# EAGLE design droneHAT (EAGLE 7.4.0)
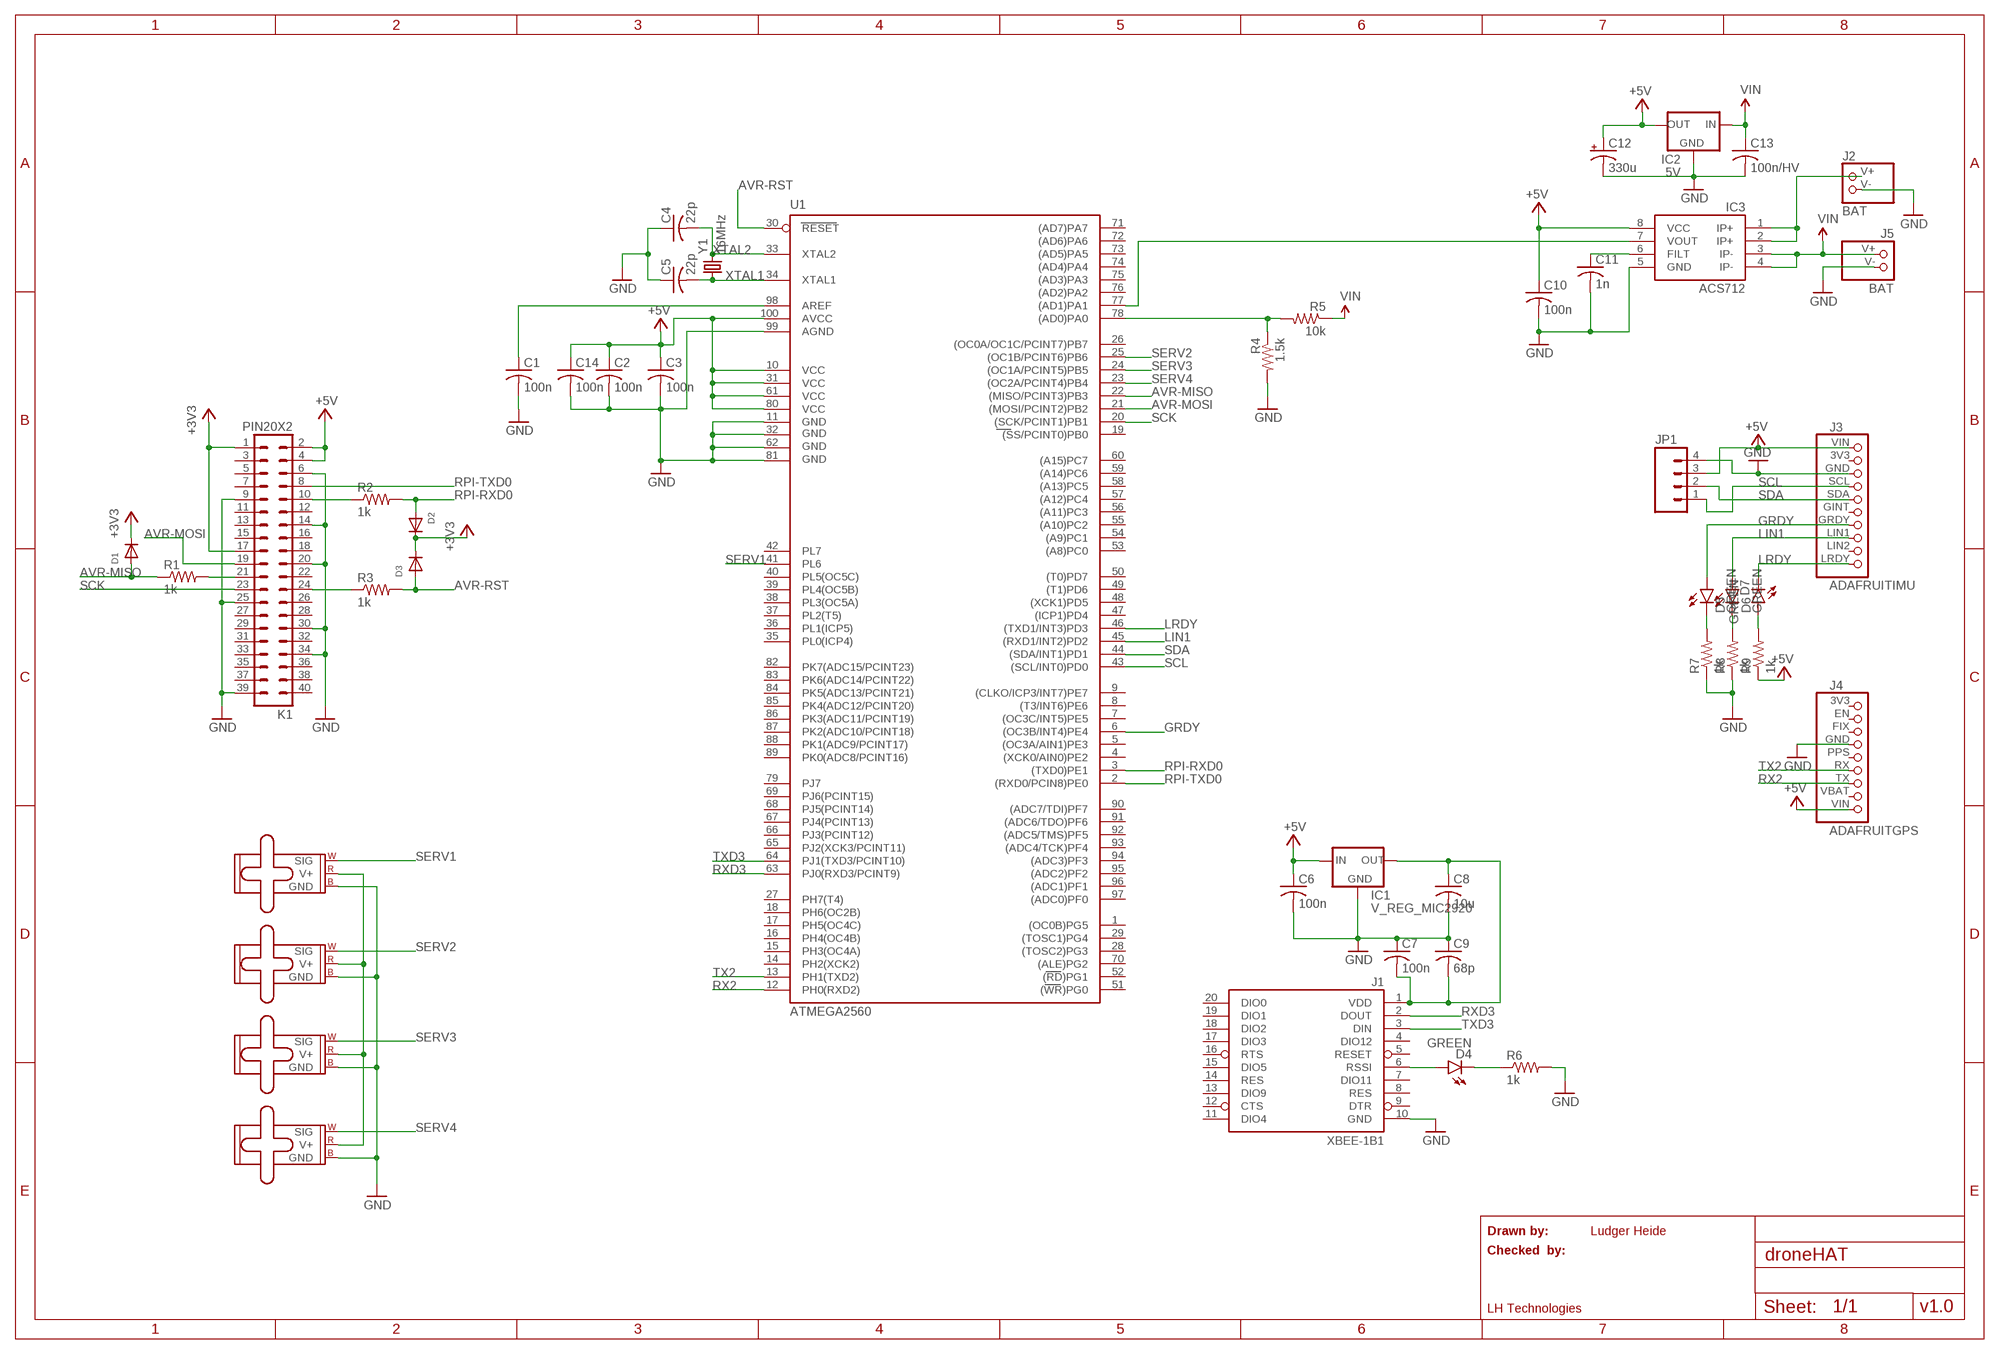
[diagram p0: schematic, sheet 1]

## Parts
C1  100n  C-USC1206  [C1206]
C2  100n  C-USC1206  [C1206]
C3  100n  C-USC1206  [C1206]
C4  22p  C-USC1206  [C1206]
C5  22p  C-USC1206  [C1206]
C6  100n  C-USC1206  [C1206]
C7  100n  C-USC1206  [C1206]
C8  10u  C-USC1206  [C1206]
C9  68p  C-USC1206  [C1206]
C10  100n  C-USC1206  [C1206]
C11  1n  C-USC1206  [C1206]
C12  330u  CAP_POLPTH1  [CPOL-RADIAL-100UF-25V]
C13  100n/HV  C-USC1206  [C1206]
C14  100n  C-USC1206  [C1206]
D1  DIODEDO-1N4148  [DO-1N4148]
D2  DIODEDO-1N4148  [DO-1N4148]
D3  DIODEDO-1N4148  [DO-1N4148]
D4  GREEN  LED-GREENLARGE  [LED-1206]
D5  GREEN  LED-GREENLARGE  [LED-1206]
D6  GREEN  LED-GREENLARGE  [LED-1206]
D7  GREEN  LED-GREENLARGE  [LED-1206]
IC1  V_REG_MIC2920  [SOT223]
IC2  5V  V_REG_78XX  [TSRN1]
IC3  ACS712  [SO08]
J1  XBEE-1B1  [XBEE-1]
J2  BAT  [BAT_HDR]
J3  ADAFRUITIMU  [ADAIMU]
J4  ADAFRUITGPS  [ADAGPS]
J5  BAT  [BAT_HDR]
JP1  M04PTH  [1X04]
K1  PIN20X2  [PIN_20X2]
M1  SMALL_SERVO  [1X03]
M2  SMALL_SERVO  [1X03]
M3  SMALL_SERVO  [1X03]
M4  SMALL_SERVO  [1X03]
R1  1k  R-US_M1206  [M1206]
R2  1k  R-US_M1206  [M1206]
R3  1k  R-US_M1206  [M1206]
R4  1.5k  R-US_M1206  [M1206]
R5  10k  R-US_M1206  [M1206]
R6  1k  R-US_M1206  [M1206]
R7  1k  R-US_M1206  [M1206]
R8  1k  R-US_M1206  [M1206]
R9  1k  R-US_M1206  [M1206]
U1  ATMEGA2560  [TQFP100-LONG]
Y1  16MHz  CRYSTALHC49US  [HC49US]

## Nets
3V3-INTERN [lowPower]: C7.2 C8.1 C9.2 IC1.3(OUT) J1.1(VDD)
+3V3: D1.C D2.C D3.C K1.1 K1.17
+5V [lowPower]: C2.1 C3.1 C6.1 C10.1 C12.1(+) C14.1 IC1.1(IN) IC2.3(OUT) IC3.8(VCC) J3.VIN J4.VIN JP1.3 K1.2 K1.4 R9.1 U1.10(VCC) U1.31(VCC1) U1.61(VCC2) U1.80(VCC3) U1.100(AVCC)
AVR-MISO: D1.A R1.1 U1.22((MISO/PCINT3)PB3)
AVR-MOSI: K1.19 U1.21((MOSI/PCINT2)PB2)
AVR-RST: D3.A R3.2 U1.30(RESET)
BAT_IN [batPower]: IC3.1(IP+) IC3.2(IP+) J2.V+
GND [lowPower]: C1.2 C2.2 C3.2 C4.1 C5.1 C6.2 C7.1 C8.2 C9.1 C10.2 C11.2 C12.2(-) C13.2 C14.2 IC1.2(GND) IC2.2(GND) IC3.5(GND) J1.10(GND) J2.V- J3.GND J4.GND J5.V- JP1.4 K1.6 K1.9 K1.14 K1.20 K1.25 K1.30 K1.34 K1.39 M1.3(GND) M2.3(GND) M3.3(GND) M4.3(GND) R4.2 R6.2 R7.1 R8.1 U1.11(GND) U1.32(GND1) U1.62(GND2) U1.81(GND3) U1.99(AGND)
GRDY: D5.A J3.GRDY U1.6((OC3B/INT4)PE4)
LIN1: D6.A J3.LIN1 U1.45((RXD1/INT2)PD2)
LRDY: D7.C J3.LRDY U1.46((TXD1/INT3)PD3)
N$1: C1.1 U1.98(AREF)
N$2 [lowPower]: M1.2(V+) M2.2(V+) M3.2(V+) M4.2(V+)
N$3: C11.1 IC3.6(FILT)
N$4: D4.A J1.6(RSSI)
N$5: D4.C R6.1
N$6: D5.C R7.2
N$7: K1.21 R1.2
N$8: K1.24 R3.1
N$9: K1.10 R2.1
N$10: D6.C R8.2
N$11: D7.A R9.2
N$13: R4.1 R5.2 U1.78((AD0)PA0)
N$19: IC3.7(VOUT) U1.77((AD1)PA1)
RPI-RXD0: D2.A R2.2 U1.3((TXD0)PE1)
RPI-TXD0: K1.8 U1.2((RXD0/PCIN8)PE0)
RX2: J4.TX U1.12(PH0(RXD2))
RXD3: J1.2(DOUT) U1.63(PJ0(RXD3/PCINT9))
SCK: K1.23 U1.20((SCK/PCINT1)PB1)
SCL: J3.SCL JP1.1 U1.43((SCL/INT0)PD0)
SDA: J3.SDA JP1.2 U1.44((SDA/INT1)PD1)
SERV1: M1.1(SIG) U1.41(PL6)
SERV2: M2.1(SIG) U1.25((OC1B/PCINT6)PB6)
SERV3: M3.1(SIG) U1.24((OC1A/PCINT5)PB5)
SERV4: M4.1(SIG) U1.23((OC2A/PCINT4)PB4)
TX2: J4.RX U1.13(PH1(TXD2))
TXD3: J1.3(DIN) U1.64(PJ1(TXD3/PCINT10))
VIN [batPower]: C13.1 IC2.1(IN) IC3.3(IP-) IC3.4(IP-) J5.V+ R5.1
XTAL1: C5.2 U1.34(XTAL1) Y1.1
XTAL2: C4.2 U1.33(XTAL2) Y1.2
Unconnected: J1.4(DIO12) J1.5(RESET) J1.7(DIO11) J1.8(RES) J1.9(DTR) J1.11(DIO4) J1.12(CTS) J1.13(DIO9) J1.14(RES) J1.15(DIO5) J1.16(RTS) J1.17(DIO3) J1.18(DIO2) J1.19(DIO1) J1.20(DIO0) J3.3V3 J3.GINT J3.LIN2 J4.3V3 J4.EN J4.FIX J4.PPS J4.VBAT K1.3 K1.5 K1.7 K1.11 K1.12 K1.13 K1.15 K1.16 K1.18 K1.22 K1.26 K1.27 K1.28 K1.29 K1.31 K1.32 K1.33 K1.35 K1.36 K1.37 K1.38 K1.40 U1.1((OC0B)PG5) U1.4((XCK0/AIN0)PE2) U1.5((OC3A/AIN1)PE3) U1.7((OC3C/INT5)PE5) U1.8((T3/INT6)PE6) U1.9((CLKO/ICP3/INT7)PE7) U1.14(PH2(XCK2)) U1.15(PH3(OC4A)) U1.16(PH4(OC4B)) U1.17(PH5(OC4C)) U1.18(PH6(OC2B)) U1.19((SS/PCINT0)PB0) U1.26((OC0A/OC1C/PCINT7)PB7) U1.27(PH7(T4)) U1.28((TOSC2)PG3) U1.29((TOSC1)PG4) U1.35(PL0(ICP4)) U1.36(PL1(ICP5)) U1.37(PL2(T5)) U1.38(PL3(OC5A)) U1.39(PL4(OC5B)) U1.40(PL5(OC5C)) U1.42(PL7) U1.47((ICP1)PD4) U1.48((XCK1)PD5) U1.49((T1)PD6) U1.50((T0)PD7) U1.51((WR)PG0) U1.52((RD)PG1) U1.53((A8)PC0) U1.54((A9)PC1) U1.55((A10)PC2) U1.56((A11)PC3) U1.57((A12)PC4) U1.58((A13)PC5) U1.59((A14)PC6) U1.60((A15)PC7) U1.65(PJ2(XCK3/PCINT11)) U1.66(PJ3(PCINT12)) U1.67(PJ4(PCINT13)) U1.68(PJ5(PCINT14)) U1.69(PJ6(PCINT15)) U1.70((ALE)PG2) U1.71((AD7)PA7) U1.72((AD6)PA6) U1.73((AD5)PA5) U1.74((AD4)PA4) U1.75((AD3)PA3) U1.76((AD2)PA2) U1.79(PJ7) U1.82(PK7(ADC15/PCINT23)) U1.83(PK6(ADC14/PCINT22)) U1.84(PK5(ADC13/PCINT21)) U1.85(PK4(ADC12/PCINT20)) U1.86(PK3(ADC11/PCINT19)) U1.87(PK2(ADC10/PCINT18)) U1.88(PK1(ADC9/PCINT17)) U1.89(PK0(ADC8/PCINT16)) U1.90((ADC7/TDI)PF7) U1.91((ADC6/TDO)PF6) U1.92((ADC5/TMS)PF5) U1.93((ADC4/TCK)PF4) U1.94((ADC3)PF3) U1.95((ADC2)PF2) U1.96((ADC1)PF1) U1.97((ADC0)PF0)

## Notes on the sheet
- Drawn by: | Ludger Heide
- Checked  by:
- LH Technologies | v1.0

## Library data of the parts
C1-C11 C13 C14 = adafruit:C-US: CAPACITOR, American symbol
C12 = SparkFun-Capacitors:CAP_POL: Capacitor Polarized These are standard SMD and PTH capacitors. Normally 10uF, 47uF, and 100uF in electrolytic and tantalum varieties. Always verify the external diameter of the through hole cap, it varies with capacity, voltage, and manufacturer. The EIA devices should be standard.
D1-D3 = adafruit:DIODE: Diode SMADIODE - SMA Surface Mount Package 20V 1A Schottky Diode Digikey: 641-1014-6-ND DO-1N4148 - Through Hole Small Current Diode SOD-123 20V 1 A (.5mV Vf) Schottky Diode - Digikey: MBRX120TPMSCT-ND SOD-323 10V 570mA (.38mV Vf, 3ns) Schottky Diode - Digikey: ZLLS410CT-ND SOD-523 30V 30mA Schottky Diode (RB751S-40TE61) - Digikey: RB751S-40TE61CT-ND SOT23-R/W - SOT23 Package (R = Solder Paste/Reflow Ovens, W = Hand-Soldering) BAT54Film 40V 300mA - Digikey: 497-7162-1-ND
D4-D7 = SparkFun-LED:LED-GREEN: Various green LEDs Green LEDs used in SFE Production 0603- DIO-00821 LARGE- DIO-00862 LILYPAD- DIO-09910; PROD_ID: DIO-00862
IC1 = SparkFun-PowerIC:V_REG_MIC2920: MIC2920A (http://www.micrel.com/_PDF/mic2920.pdf) - 400mA output LDO Regulator
IC2 = SparkFun-PowerIC:V_REG_78XX: Voltage Regulator Standard 7805 5V regulator. IGO (Input Ground Output). Spark Fun Electronics SKU : COM-00107
IC3 = SparkFun-AnalogIC:ACS712: Hall-effect-based isolated linear current sensor
J1 = SparkFun-RF:XBEE-1: Xbee module footprints SMT header is CONN-09042.
J2 J5 = myParts:BAT
J3 = myParts:ADAFRUITIMU
J4 = myParts:ADAFRUITGPS
JP1 = SparkFun-Connectors:M04: Header 4 Standard 4-pin 0.1" header. Use with straight break away headers (SKU : PRT-00116), right angle break away headers (PRT-00553), swiss pins (PRT-00743), machine pins (PRT-00117), and female headers (PRT-00115). Molex polarized connector foot print use with SKU : PRT-08231 with associated crimp pins and housings. 1MM SMD Version SKU: PRT-10208
K1 = FLYFISH:PIN20X2
M1-M4 = SparkFun-Electromechanical:SMALL_SERVO: Small servo motor This is the small servo used in the SIK. SKU: ROB-09065
R1-R9 = adafruit:R-US_: RESISTOR, American symbol
U1 = SparkFun-DigitalIC:ATMEGA2560: Atmel 100-pin 8-bit uC 64/128/256 Kbytes FLASH 4 Kbytes EEPROM 8 Kbytes SRAM 86 General Purpose I/O pins 12-channels16-bit PWM 4 x Serial USARTs 16-channels 10-bit A/D
Y1 = SparkFun-FreqCtrl:CRYSTAL: Various standard crystals. Proven footprints. Spark Fun Electronics SKU : COM-00534

## Net classes
0 default: width 0.2 mm, drill 1 mm, clearance 0.205 mm
2 lowPower: width 0.2 mm, drill 1 mm, clearance 0.205 mm to class 0, clearance 0.205 mm to class 1, clearance 0.205 mm
3 batPower: width 1 mm, drill 1 mm, clearance 0.205 mm to class 0, clearance 0.205 mm to class 1, clearance 0.205 mm to class 2, clearance 0.205 mm

## Board
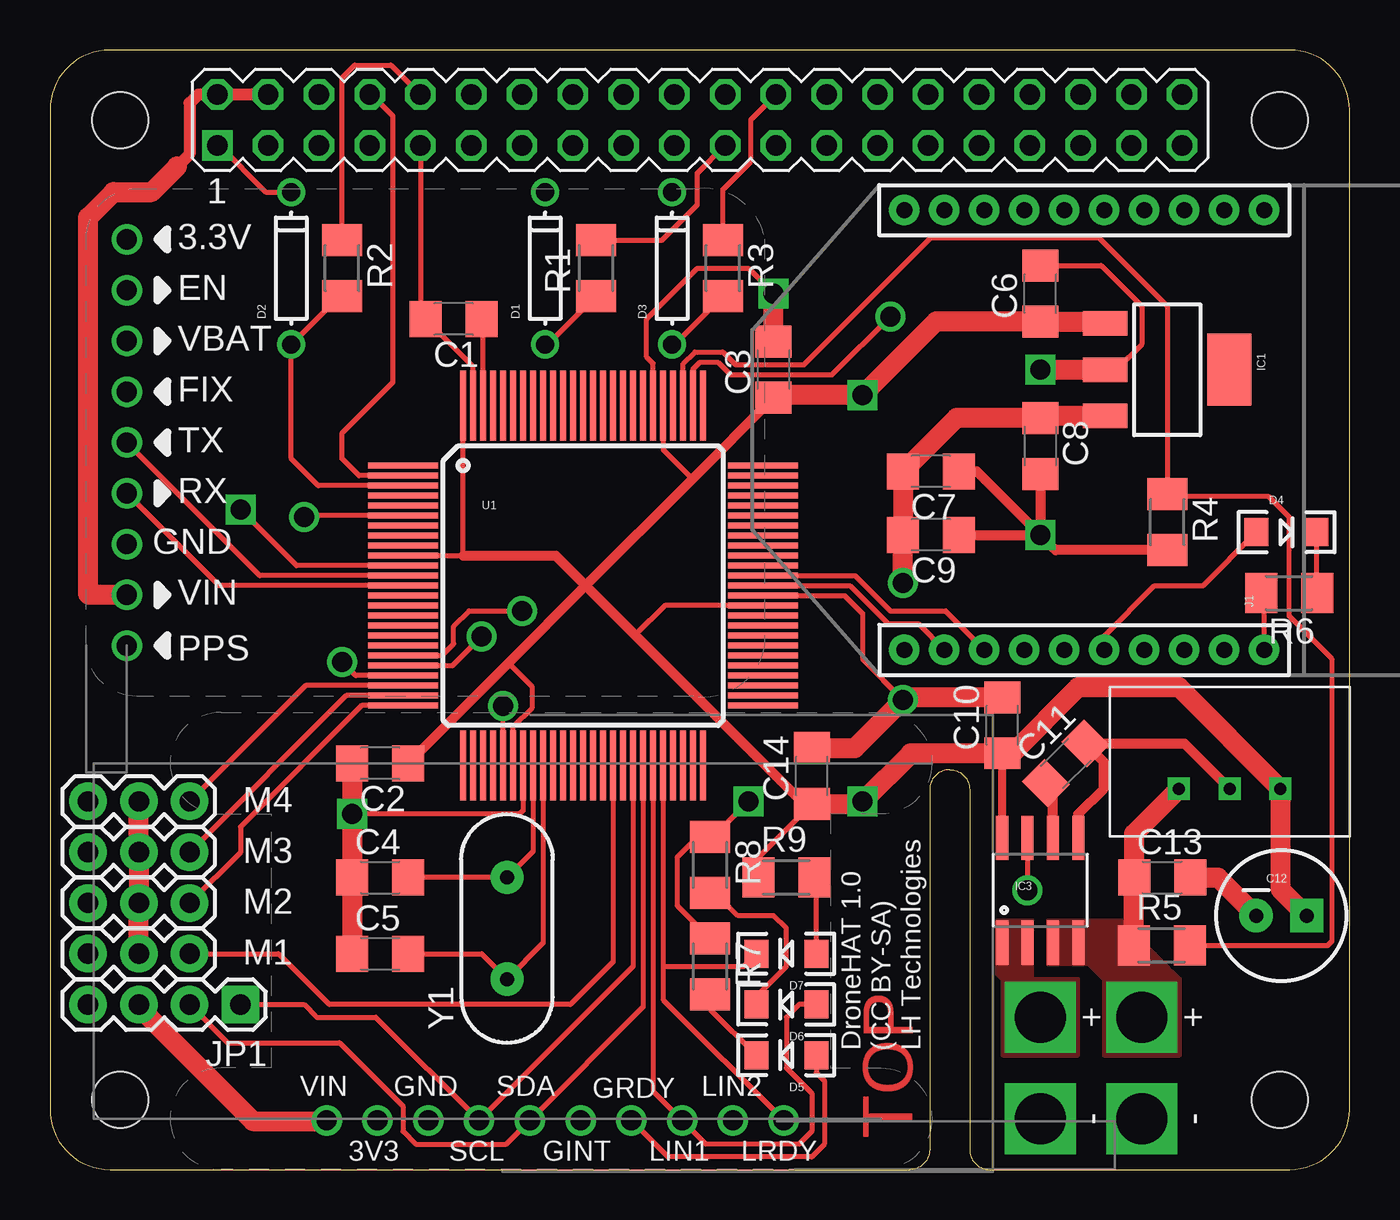
[diagram p1: board, top side]
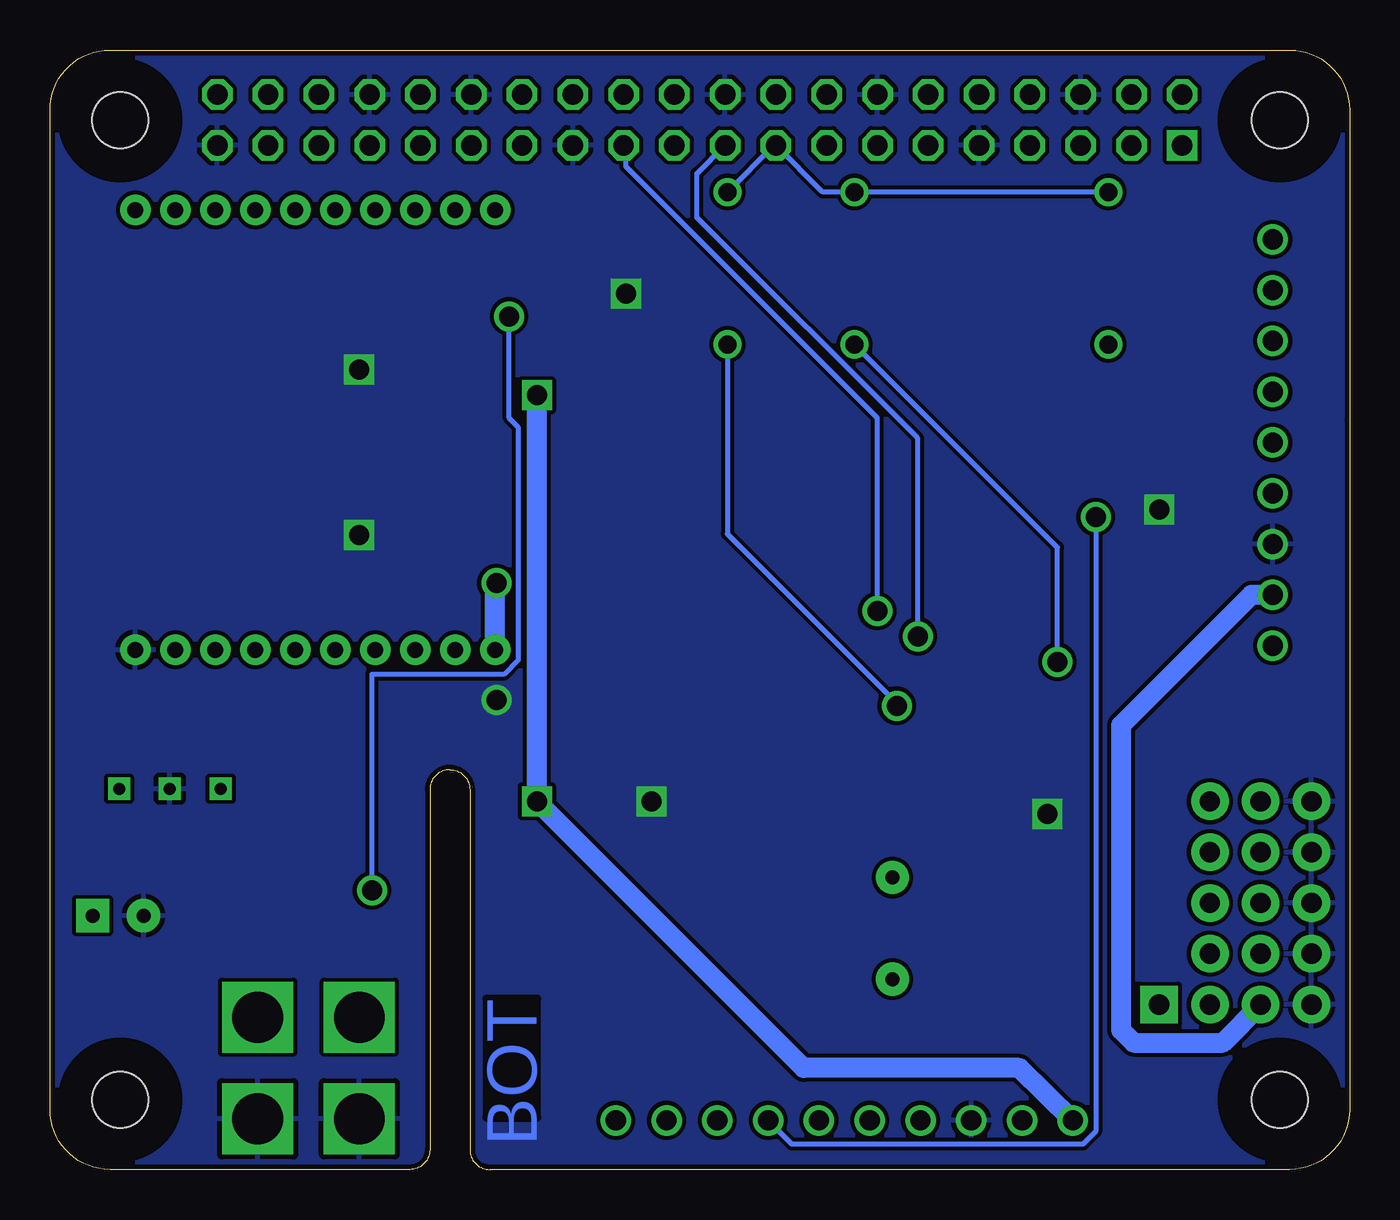
[diagram p2: board, bottom side, seen from below]

Size 65 x 56 mm. Coordinates in mm from the lower left corner, seen from the top.
Outline: 0,37.5 0,53 arc-90 3,56 62,56 arc-90 65,53 65,3 arc-90 62,0 47,0 arc-90 46,1 46,19 arc90 45,20 arc90 44,19 44,1 arc-90 43,0 3,0 arc-90 0,3 0,37.47
Copper layers (1*16): Top 0.035mm / dielectric 1.5mm / Bottom 0.035mm
Design rules "ITEADstudio_DRC *": minimum track width 0.25mm, minimum drill 0.6mm, track to track 0.2mm, track to pad 0.2mm, pad to pad 0.2mm, via to via 0.2mm, smd to smd 0mil, copper to edge 0.25mm, drill to drill 0.25mm, minimum pad ring 10mil, minimum via ring 6mil, stop-mask expansion 1mil, vias tented up to drill 100mil, thermal gap 10mil
Holes 2.8 mm at 3.5,3.5 3.5,52.5 61.5,52.5 61.5,3.5
tRestrict: area 1.9,51 to 5,54; area 60,51 to 63,54; area 60,1.9 to 63,5; area 1.9,1.9 to 5,5
bRestrict: area 1.9,1.9 to 5,5; area 1.9,51 to 5,54; area 60,1.9 to 63,5; area 60,51 to 63,54

### Footprints (pad centres in the part's own frame; a part is rotated, then mirrored left to right if it is on the bottom)
C1206 = smd 1.6 x 1.8: 1 -1.4,0; 2 1.4,0
CPOL-RADIAL-100UF-25V = drill 0.7 pad 1.651 square: 1 1.27,0 | drill 0.7 pad 1.651: 2 -1.27,0
DO-1N4148 = drill 0.9: A -3.81,0; C 3.81,0
LED-1206 = smd 1.2 x 1.4: A -1.5,0; C 1.5,0
SOT223 = smd 1.219 x 2.235: 1 -2.311,-3.099; 2 0,-3.099; 3 2.311,-3.099 | smd 3.6 x 2.2: 4 0,3.099
TSRN1 = drill 0.6 pad 1 square: 1 -2.54,0; 2 0,0; 3 2.54,0
SO08 = smd 0.61 x 2.21: 1 -1.905,-2.616; 2 -0.635,-2.616; 3 0.635,-2.616; 4 1.905,-2.616; 5 1.905,2.616; 6 0.635,2.616; 7 -0.635,2.616; 8 -1.905,2.616
XBEE-1 = drill 0.8 pad 1.524: 1 -11,20; 2 -11,18; 3 -11,16; 4 -11,14; 5 -11,12; 6 -11,10; 7 -11,8; 8 -11,6; 9 -11,4; 10 -11,2; 11 11,2; 12 11,4; 13 11,6; 14 11,8; 15 11,10; 16 11,12; 17 11,14; 18 11,16; 19 11,18; 20 11,20
BAT_HDR = drill 2.54 square: V+ -2.54,0; V- 2.54,0
ADAIMU = drill 1.016: 3V3 -7.62,-9.906; GINT 2.54,-9.906; GND -5.08,-9.906; GRDY 5.08,-9.906; LIN1 7.62,-9.906; LIN2 10.16,-9.906; LRDY 12.7,-9.906; SCL -2.54,-9.906; SDA 0,-9.906; VIN -10.16,-9.906
ADAGPS = drill 1.016: 3V3 -10.16,0.381; EN -7.62,0.381; FIX -2.54,0.381; GND 5.08,0.381; PPS 10.16,0.381; RX 2.54,0.381; TX 0,0.381; VBAT -5.08,0.381; VIN 7.62,0.381
1X04 = drill 1.016 pad 1.88 square: 1 0,0 | drill 1.016 pad 1.88: 2 2.54,0; 3 5.08,0; 4 7.62,0
PIN_20X2 = drill 1.016 square: 1 -24.13,-1.27 | drill 1.016 octagon: 2 -24.13,1.27; 3 -21.59,-1.27; 4 -21.59,1.27; 5 -19.05,-1.27; 6 -19.05,1.27; 7 -16.51,-1.27; 8 -16.51,1.27; 9 -13.97,-1.27; 10 -13.97,1.27; 11 -11.43,-1.27; 12 -11.43,1.27; 13 -8.89,-1.27; 14 -8.89,1.27; 15 -6.35,-1.27; 16 -6.35,1.27; 17 -3.81,-1.27; 18 -3.81,1.27; 19 -1.27,-1.27; 20 -1.27,1.27; 21 1.27,-1.27; 22 1.27,1.27; 23 3.81,-1.27; 24 3.81,1.27; 25 6.35,-1.27; 26 6.35,1.27; 27 8.89,-1.27; 28 8.89,1.27; 29 11.43,-1.27; 30 11.43,1.27; 31 13.97,-1.27; 32 13.97,1.27; 33 16.51,-1.27; 34 16.51,1.27; 35 19.05,-1.27; 36 19.05,1.27; 37 21.59,-1.27; 38 21.59,1.27; 39 24.13,-1.27; 40 24.13,1.27
1X03 = drill 1.016 pad 1.88: 1 0,0; 2 2.54,0; 3 5.08,0
M1206 = smd 1.6 x 2: 1 -1.4,0; 2 1.4,0
TQFP100-LONG = smd 3.5 x 0.3: 1 -9,6; 2 -9,5.5; 3 -9,5; 4 -9,4.5; 5 -9,4; 6 -9,3.5; 7 -9,3; 8 -9,2.5; 9 -9,2; 10 -9,1.5; 11 -9,1; 12 -9,0.5; 13 -9,0; 14 -9,-0.5; 15 -9,-1; 16 -9,-1.5; 17 -9,-2; 18 -9,-2.5; 19 -9,-3; 20 -9,-3.5; 21 -9,-4; 22 -9,-4.5; 23 -9,-5; 24 -9,-5.5; 25 -9,-6; 51 9,-6; 52 9,-5.5; 53 9,-5; 54 9,-4.5; 55 9,-4; 56 9,-3.5; 57 9,-3; 58 9,-2.5; 59 9,-2; 60 9,-1.5; 61 9,-1; 62 9,-0.5; 63 9,0; 64 9,0.5; 65 9,1; 66 9,1.5; 67 9,2; 68 9,2.5; 69 9,3; 70 9,3.5; 71 9,4; 72 9,4.5; 73 9,5; 74 9,5.5; 75 9,6 | smd 0.3 x 3.5: 26 -6,-9; 27 -5.5,-9; 28 -5,-9; 29 -4.5,-9; 30 -4,-9; 31 -3.5,-9; 32 -3,-9; 33 -2.5,-9; 34 -2,-9; 35 -1.5,-9; 36 -1,-9; 37 -0.5,-9; 38 0,-9; 39 0.5,-9; 40 1,-9; 41 1.5,-9; 42 2,-9; 43 2.5,-9; 44 3,-9; 45 3.5,-9; 46 4,-9; 47 4.5,-9; 48 5,-9; 49 5.5,-9; 50 6,-9; 76 6,9; 77 5.5,9; 78 5,9; 79 4.5,9; 80 4,9; 81 3.5,9; 82 3,9; 83 2.5,9; 84 2,9; 85 1.5,9; 86 1,9; 87 0.5,9; 88 0,9; 89 -0.5,9; 90 -1,9; 91 -1.5,9; 92 -2,9; 93 -2.5,9; 94 -3,9; 95 -3.5,9; 96 -4,9; 97 -4.5,9; 98 -5,9; 99 -5.5,9; 100 -6,9
HC49US = drill 0.7 pad 1.651: 1 -2.54,0; 2 2.54,0

### Placement (x,y rotation side)
C1  20.19,42.55 180 top
C2  16.51,20.32 180 top
C3  36.2,40.01 90 top
C4  16.51,14.61 0 top
C5  16.51,10.79 0 top
C6  49.53,43.81 90 top
C7  44.07,34.92 180 top
C8  49.53,36.2 270 top
C9  44.07,31.75 180 top
C10  47.62,22.23 90 top
C11  50.8,20.32 45 top
C12  61.59,12.7 0 top
C13  55.63,14.61 0 top
C14  38.1,19.68 90 top
D1  24.77,45.09 90 top
D2  12.06,45.09 90 top
D3  31.11,45.09 90 top
D4  61.85,31.88 0 top
D5  36.83,5.71 180 top
D6  36.83,8.26 180 top
D7  36.83,10.79 180 top
IC1  55.88,40.01 270 top
IC2  59,19.05 0 top
IC3  49.53,13.97 0 top
J1  62.73,37 90 top
J2  49.53,5.08 270 top
J3  24,12.37 0 top
J4  3.46,36.37 270 top
J5  54.61,5.08 270 top
JP1  9.53,8.26 180 top
K1  32.5,52.5 0 top
M1  6.99,10.79 180 top
M2  6.99,13.34 180 top
M3  6.99,15.88 180 top
M4  6.99,18.41 180 top
R1  27.3,45.09 90 top
R2  14.61,45.09 270 top
R3  33.66,45.09 270 top
R4  55.88,32.38 270 top
R5  55.6,11.21 0 top
R6  61.98,28.83 180 top
R7  33.02,10.16 270 top
R8  33.02,15.24 270 top
R9  36.83,14.61 0 top
U1  26.67,29.21 0 top
Y1  22.86,12.06 90 top

### Tracks (layer width: path | path; a pad name or v marks a point on that pad's centre or on a via)
3V3-INTERN  (via drill 1)
  Top 1: IC1.3 49.53,37.69 C8.1 45.34,37.59 C7.2 C9.2 v42.67,29.34
  Bottom 1: J1.1 42.73,29.28 v42.67,29.34
+3V3
  Top 0.25: K1.1 8.46,51.23 10.79,48.9 D2.C
  Bottom 0.25: D2.C D1.C 26.36,48.9 K1.17 28.78,51.23 D3.C
+5V  (via drill 1)
  Top 0.25: U1.100 20.67,30.71 U1.10 | U1.80 30.67,36.01 32.13,34.54 | U1.61 30.75,28.21 29.27,26.73 | U1.31 23.17,22.15 24.13,23.11 24.13,24.13 22.93,25.34 | R9.1 35.43,15.62 C14.1
  Top 0.406: IC3.8 C10.1
  Top 0.5: C2.1 22.93,25.34 26.8,29.21 | 26.8,29.21 32.13,34.54 C3.1 | 26.8,29.21 25.3,30.71 20.67,30.71 | 26.8,29.21 29.27,26.73 37.85,18.16
  Top 0.6: 6.35,50.16 6.99,50.8 6.99,53.34 7.42,53.77 K1.2 K1.4
  Top 1: IC1.1 52.78,42.41 C6.1 44.32,42.41 v40.64,38.73 36.2,38.73 C3.1 | 6.35,50.16 5.08,48.9 3.17,48.9 1.91,47.62 1.91,28.8 1.96,28.75 J4.VIN | JP1.3 4.45,8.13 10.16,2.41 13.79,2.41 J3.VIN | C14.1 40.51,18.29 v40.64,18.41 43.05,20.82 C10.1 48.13,20.82 51.44,24.13 56.46,24.13 IC2.3 61.54,14.02 C12.1
  Bottom 1: v40.64,38.73 v40.64,18.41 27.3,5.08 16.51,5.08 J3.VIN | J4.VIN 4.91,28.75 11.43,22.23 11.43,6.99 10.79,6.35 6.35,6.35 JP1.3
AVR-MISO  (via drill 1)
  Top 0.25: D1.A 24.89,41.27 R1.1 | U1.22 15.29,24.71 v14.61,25.4
  Bottom 0.25: v14.61,25.4 14.61,31.11 D1.A
AVR-MOSI  (via drill 1)
  Top 0.25: U1.21 20.13,25.21 v21.59,26.67
  Bottom 0.25: v21.59,26.67 21.59,36.58 32.64,47.62 32.64,49.82 K1.19
AVR-RST  (via drill 1)
  Top 0.25: D3.A 31.25,41.27 R3.2 | U1.30 22.67,23.18 v22.65,23.2
  Bottom 0.25: D3.A 31.11,31.79 22.65,23.32 v22.65,23.2
BAT_IN
  pour Top (no thermals): 47.62,9.53 47.62,5.71 51.44,5.71 51.44,9.53 49.15,9.53 49.15,12.45 47.37,12.45 47.37,9.78
GND  (via drill 1, 1 pad 1)
  Top 0.25: 34.7,28.7 U1.62 39.74,28.71 40.64,27.81 40.64,25.53 v42.67,23.5 | U1.32 23.67,17.95 23.5,17.78 v15.11,17.78 | U1.11 12.34,30.21 v9.53,33.02 | K1.9 18.53,42.81 C1.2 21.17,40.17 U1.99 | C6.2 52.58,45.22 54.61,43.18 54.61,41.27 53.34,40.01 IC1.2 | U1.81 30.17,40.31 29.84,40.64 29.84,42.55 32.38,45.09 34.92,45.09 v36.2,43.81 | R7.1 31.37,13.21 31.37,15.62 32.39,16.64 R8.1 33.15,16.51 33.15,16.64 v34.92,18.41 | J1.10 60.73,28.68 R6.2
  Top 0.5: C9.1 v49.53,31.75 | C8.2 v49.53,31.75 | C7.1 46.35,34.92 v49.53,31.75 | R4.2 50.3,30.98 v49.53,31.75 | IC3.5 51.44,17.78 52.7,19.05 52.7,20.39 C11.2 56.74,21.31 IC2.2
  Top 1: C3.2 v36.2,43.81 | C2.2 v15.11,17.78 C4.1 C5.1 | C10.2 42.8,23.62 v42.67,23.5 40.26,21.09 C14.2 | v49.53,40.01 IC1.2 | C13.2 58.42,14.61 C12.2
  pour Bottom: 0,3 arc90 3,0 43,0 arc90 44,1 44,19 arc-90 45,20 arc-90 46,19 46,1 arc90 47,0 62,0 arc90 65,3 65,53 arc90 62,56 3,56 arc90 0,53 0,18.5
GRDY  (via drill 1)
  Top 0.25: U1.6 12.77,32.71 v12.7,32.64 | D5.A 38.33,4.85 38.73,4.45 38.73,1.27 38.1,0.64 30.9,0.64 J3.GRDY
  Bottom 0.25: v12.7,32.64 12.7,1.91 13.34,1.27 27.89,1.27 J3.GRDY
LIN1
  Top 0.25: D6.A 37.47,8.26 36.83,7.62 36.83,5.08 38.1,3.81 38.1,1.91 37.47,1.27 32.81,1.27 J3.LIN1 30.17,3.91 U1.45
LRDY
  Top 0.25: U1.46 30.67,10.16 | 30.67,10.16 30.67,8.49 J3.LRDY | 30.67,10.16 34.7,10.16 D7.C
N$1
  Top 0.25: U1.98 21.67,42.47 C1.1
N$2
  Top 1: M1.2 M2.2 M3.2 M4.2
N$3
  Top 0.25: 50.16,18.98 C11.1
  Top 0.5: IC3.6 50.16,18.98
N$4
  Top 0.25: J1.6 52.73,26.7 55.24,29.21 57.68,29.21 D4.A
N$5
  Top 0.25: D4.C 63.35,28.86 R6.1
N$6
  Top 0.25: R7.2 33.02,8.03 D5.C
N$7
  Top 0.25: R1.2 30.61,46.48 32.38,48.26 32.38,49.84 K1.21
N$8
  Top 0.25: R3.1 33.66,49.02 35.05,50.42 35.05,52.51 K1.24
N$9
  Top 0.25: R2.1 14.61,54.61 15.24,55.24 17.05,55.24 K1.10
N$10
  Top 0.25: D6.C 35.33,8.66 36.83,10.16 36.83,12.06 36.2,12.7 34.42,12.7 33.53,13.59 33.27,13.59 R8.2
N$11
  Top 0.25: D7.A 38.33,14.51 R9.2
N$13
  Top 0.25: U1.78 31.67,40.31 32.26,40.89 33.66,40.89 34.29,40.26 37.72,40.26 44.07,46.61 52.45,46.61 55.88,43.18 R4.1 56.01,33.66 60.96,33.66 61.98,32.64 61.98,27.69 64.14,25.53 64.14,11.43 63.91,11.21 R5.2
N$19  (via drill 1)
  Top 0.25: IC3.7 v48.9,13.97 | U1.77 32.17,40.04 32.51,40.39 33.4,40.39 34.04,39.75 39.12,39.75 v42.04,42.67
  Bottom 0.25: v48.9,13.97 48.9,24.77 42.29,24.77 41.58,25.48 41.58,37.13 42.04,37.59 v42.04,42.67
RPI-RXD0
  Top 0.25: U1.3 13.41,34.21 12.06,35.56 D2.A 14.47,43.69 R2.2
RPI-TXD0
  Top 0.25: K1.8 16.08,53.77 17.14,52.7 17.14,39.37 14.61,36.83 14.61,35.56 15.46,34.71 U1.2
RX2
  Top 0.25: U1.12 10.5,29.71 J4.TX
RXD3
  Top 0.25: U1.63 40.01,29.21 41.91,27.3 43.42,27.3 J1.2
SCK  (via drill 1)
  Top 0.25: U1.20 19.61,25.71 20.19,26.29 20.19,27.18 20.95,27.94 v23.62,27.94
  Bottom 0.25: v23.62,27.94 23.62,37.59 36.2,50.16 36.2,51.12 K1.23
SCL
  Top 0.25: U1.43 29.17,10.17 J3.SCL 16.3,7.62 13.34,7.62 12.7,8.26 JP1.1
SDA
  Top 0.25: U1.44 29.67,8.13 J3.SDA 22.81,1.27 18.29,1.27 17.65,1.91 17.65,3.17 14.48,6.35 8.89,6.35 JP1.2
SERV1
  Top 0.25: M1.1 11.43,10.79 13.65,8.57 13.97,8.26 26.04,8.26 28.17,10.39 U1.41
SERV2
  Top 0.25: U1.25 15.59,23.21 9.53,17.14 9.53,15.88 M2.1
SERV3
  Top 0.25: U1.24 14.82,23.71 M3.1
SERV4
  Top 0.25: U1.23 12.78,24.21 M4.1
TX2
  Top 0.25: U1.13 8.46,29.21 J4.RX
TXD3
  Top 0.25: U1.64 40.27,29.71 42.04,27.94 44.79,27.94 J1.3
VIN
  Top 1: R5.1 54.2,14.58 C13.1 54.23,16.81 IC2.1
  pour Top (no thermals): 56.52,5.71 56.52,9.53 55.24,10.79 53.59,12.45 49.91,12.45 49.91,10.29 51.69,10.29 51.94,10.29 52.7,9.53 52.7,5.71
XTAL1
  Top 0.25: U1.34 24.67,11.34 Y1.1 21.59,10.79 C5.2
XTAL2
  Top 0.25: C4.2 Y1.2 24.17,15.91 U1.33

### Text on the board
Top: TOP
Bottom: BOT
tPlace: DroneHAT 1.0 / (CC BY-SA) / LH Technologies